# EAGLE design car_bt (EAGLE 7.5.0)
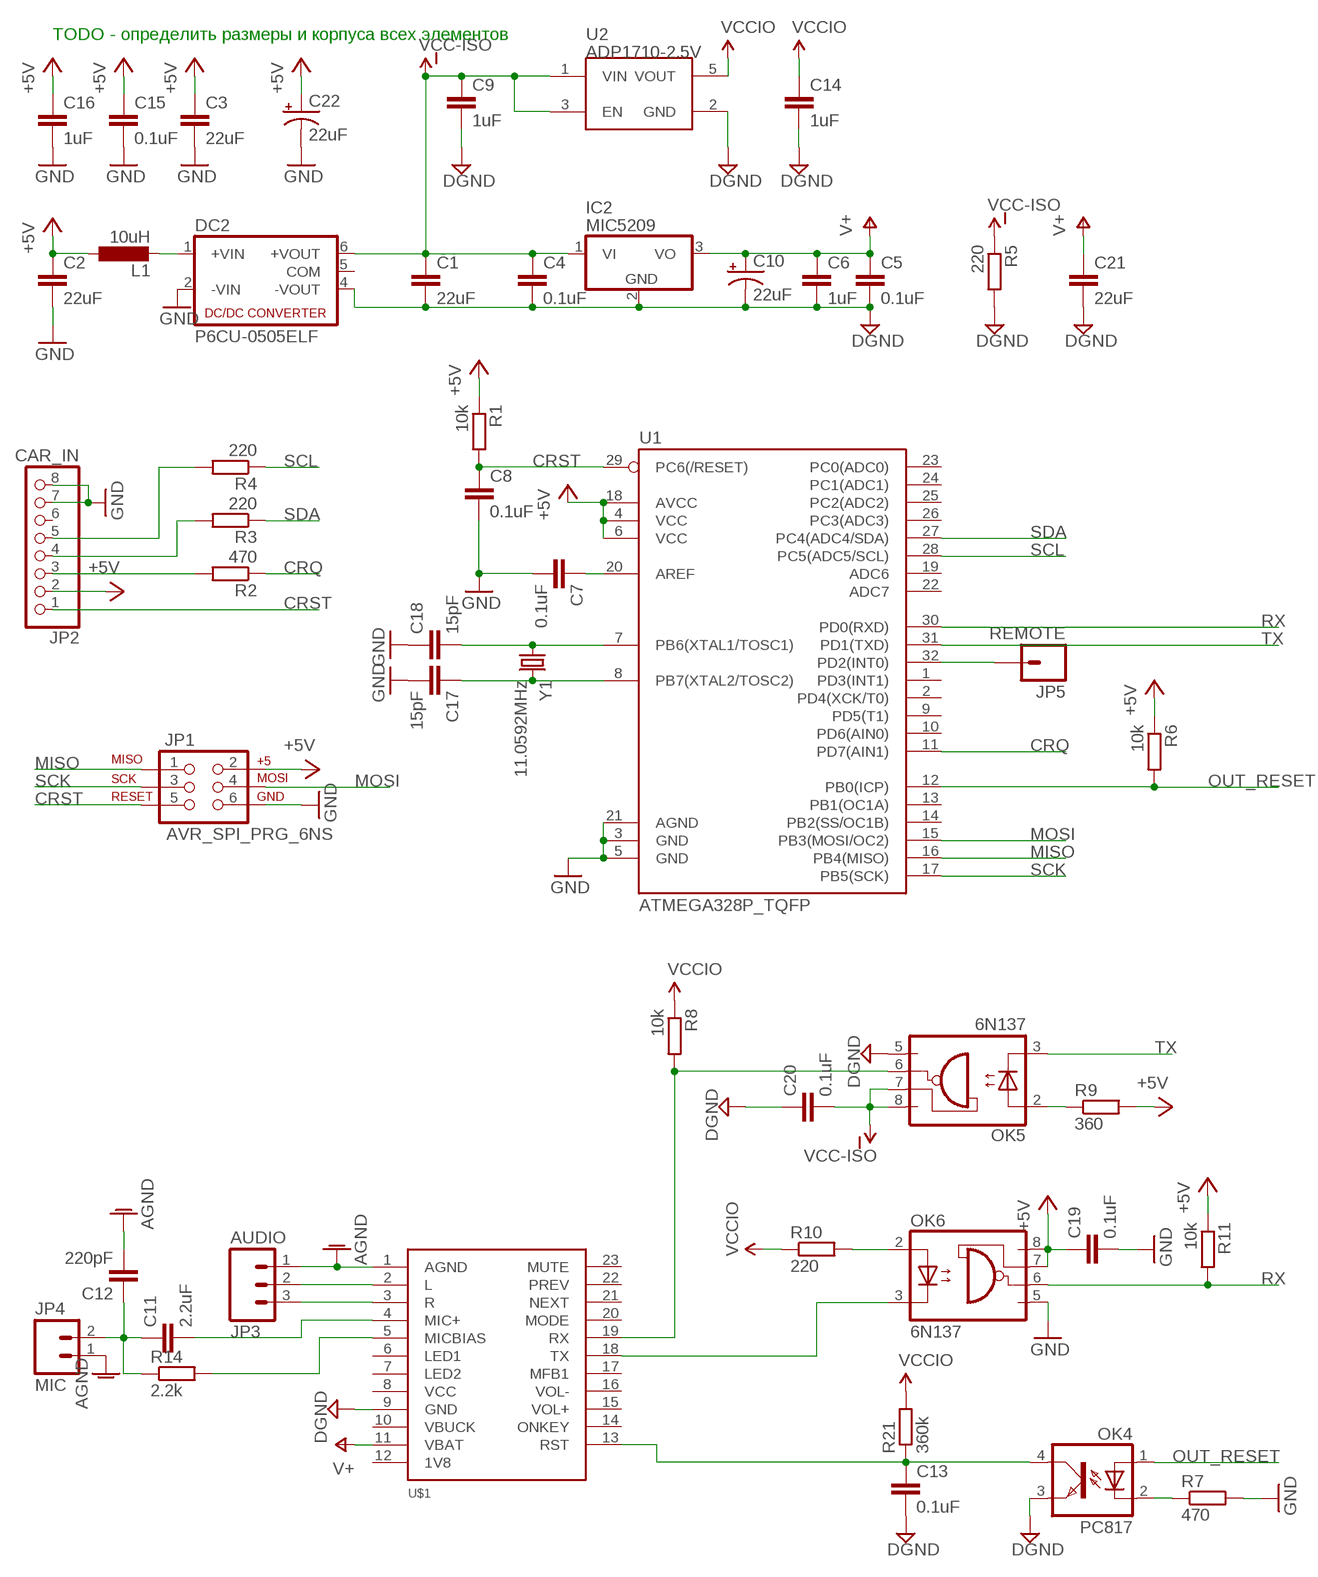
[diagram p0: schematic, sheet 1]

## Parts
C1  22uF  C-EUC1206  [C1206]
C2  22uF  C-EUC1206  [C1206]
C3  22uF  C-EUC1206  [C1206]
C4  0.1uF  C-EUC0805  [C0805]
C5  0.1uF  C-EUC0805  [C0805]
C6  1uF  C-EUC0805  [C0805]
C7  0.1uF  C-EUC0805  [C0805]
C8  0.1uF  C-EUC0805  [C0805]
C9  1uF  C-EUC0805  [C0805]
C10  22uF  CAP_POL3528  [EIA3528]
C11  2.2uF  C-EUC0805  [C0805]
C12  220pF  C-EUC0805  [C0805]
C13  0.1uF  C-EUC0805  [C0805]
C14  1uF  C-EUC0805  [C0805]
C15  0.1uF  C-EUC0805  [C0805]
C16  1uF  C-EUC0805  [C0805]
C17  15pF  C-EUC0805  [C0805]
C18  15pF  C-EUC0805  [C0805]
C19  0.1uF  C-EUC0805  [C0805]
C20  0.1uF  C-EUC0805  [C0805]
C21  22uF  C-EUC1206  [C1206]
C22  22uF  CAP_POL3528  [EIA3528]
DC2  P6CU-0505ELF  NMA  [NMA]
IC2  MIC5209  MCP1703DB  [SOT223]
JP1  AVR_SPI_PRG_6NS  [2X3-NS]
JP2  CAR_IN  PINHD-1X8/90  [1X08/90]
JP3  AUDIO  M03POLAR  [MOLEX-1X3]
JP4  MIC  M02POLAR_LOCK  [MOLEX-1X2_LOCK]
JP5  REMOTE  M01PTH_LONGPAD  [1X01_LONGPAD]
L1  10uH  L-EUL3216C  [L3216C]
OK4  PC817  [DIL04]
OK5  6N137  [DIL08]
OK6  6N137  [DIL08]
R1  10k  R-EU_R0805  [R0805]
R2  470  R-EU_R0805  [R0805]
R3  220  R-EU_R0805  [R0805]
R4  220  R-EU_R0805  [R0805]
R5  220  R-EU_R0805  [R0805]
R6  10k  R-EU_R0805  [R0805]
R7  470  R-EU_R0805  [R0805]
R8  10k  R-EU_R0805  [R0805]
R9  360  R-EU_R0805  [R0805]
R10  220  R-EU_R1206  [R1206]
R11  10k  R-EU_R0805  [R0805]
R14  2.2k  R-EU_R0805  [R0805]
R21  360k  R-EU_R0805  [R0805]
U1  ATMEGA328P_TQFP  [TQFP32-08]
U2  ADP1710-2.5V  ADP160  [SOT23-5]
U$1  XS3868  [XS3868]
Y1  11.0592MHz  CRYSTALHC49UV  [HC49U-V]

## Nets
+5V [HI_PWR]: C2.1 C3.1 C15.1 C16.1 C19.1 C22.A(+) JP1.2 JP2.2 L1.1 OK6.7(VE) OK6.8(VCC) R1.1 R6.1 R9.2 R11.1 U1.4(VCC) U1.6(VCC) U1.18(AVCC)
AGND [HI_PWR]: C12.2 JP3.1 JP4.1 U$1.1(AGND)
CRQ [PWR]: R2.1 U1.11(PD7(AIN1))
CRST [PWR]: C8.1 JP1.5 JP2.1 R1.2 U1.29(PC6(/RESET))
DGND [HI_PWR]: C1.2 C4.2 C5.2 C6.2 C9.2 C10.C(-) C13.2 C14.2 C20.1 C21.2 DC2.4(-VOUT) IC2.2(GND) OK4.3(EMIT) OK5.5(GND) R5.2 U2.2(GND) U$1.9(GND)
GND [HI_PWR]: C2.2 C3.2 C7.2 C8.2 C15.2 C16.2 C17.2 C18.1 C19.2 C22.C(-) DC2.2(-VIN) JP1.6 JP2.7 JP2.8 OK6.5(GND) R7.2 U1.3(GND) U1.5(GND) U1.21(AGND)
MISO: JP1.1 U1.16(PB4(MISO))
MOSI: JP1.4 U1.15(PB3(MOSI/OC2))
N$1 [PWR]: JP2.3 R2.2
N$2 [PWR]: JP2.4 R3.2
N$3 [PWR]: JP2.5 R4.2
N$4 [HI_PWR]: DC2.1(+VIN) L1.2
N$5: OK6.3(C) U$1.18(TX)
N$6: C7.1 U1.20(AREF)
N$7 [PWR]: C11.1 C12.1 JP4.2 R14.1
N$8 [PWR]: JP3.2 U$1.2(L)
N$9 [PWR]: JP3.3 U$1.3(R)
N$10 [PWR]: JP5.1 U1.32(PD2(INT0))
N$11 [PWR]: OK5.2(A) R9.1
N$12 [PWR]: C13.1 OK4.4(COL) R21.1 U$1.13(RST)
N$13: C17.1 U1.8(PB7(XTAL2/TOSC2)) Y1.2
N$14 [PWR]: OK5.6(VO) R8.2 U$1.19(RX)
N$15 [PWR]: OK6.2(A) R10.2
N$16: C18.2 U1.7(PB6(XTAL1/TOSC1)) Y1.1
N$18: OK4.2(C) R7.1
N$19 [PWR]: C11.2 U$1.4(MIC+)
N$20 [PWR]: R14.2 U$1.5(MICBIAS)
OUT_RESET [PWR]: OK4.1(A) R6.2 U1.12(PB0(ICP))
RX [PWR]: OK6.6(VO) R11.2 U1.30(PD0(RXD))
SCK: JP1.3 U1.17(PB5(SCK))
SCL [PWR]: R4.1 U1.28(PC5(ADC5/SCL))
SDA [PWR]: R3.1 U1.27(PC4(ADC4/SDA))
TX [PWR]: OK5.3(C) U1.31(PD1(TXD))
V+ [HI_PWR]: C5.1 C6.1 C10.A(+) C21.1 IC2.3(VO) U$1.11(VBAT)
VCC-ISO [HI_PWR]: C1.1 C4.1 C9.1 C20.2 DC2.6(+VOUT) IC2.1(VI) OK5.7(VE) OK5.8(VCC) R5.1 U2.1(VIN) U2.3(EN)
VCCIO [PWR]: C14.1 R8.1 R10.1 R21.2 U2.5(VOUT)
Unconnected: DC2.5(COM) JP2.6 U1.1(PD3(INT1)) U1.2(PD4(XCK/T0)) U1.9(PD5(T1)) U1.10(PD6(AIN0)) U1.13(PB1(OC1A)) U1.14(PB2(SS/OC1B)) U1.19(ADC6) U1.22(ADC7) U1.23(PC0(ADC0)) U1.24(PC1(ADC1)) U1.25(PC2(ADC2)) U1.26(PC3(ADC3)) U$1.6(LED1) U$1.7(LED2) U$1.8(VCC) U$1.10(VBUCK) U$1.12(1V8) U$1.14(ONKEY) U$1.15(VOL+) U$1.16(VOL-) U$1.17(MFB1) U$1.20(MODE) U$1.21(NEXT) U$1.22(PREV) U$1.23(MUTE)

## Notes on the sheet
- TODO - определить размеры и корпуса всех элементов

## Library data of the parts
C1-C9 C11-C21 = resistor:C-EU: CAPACITOR, European symbol
C10 C22 = SparkFun-Passives:CAP_POL: Capacitor Polarized These are standard SMD and PTH capacitors. Normally 10uF, 47uF, and 100uF in electrolytic and tantalum varieties. Always verify the external diameter of the through hole cap, it varies with capacity, voltage, and manufacturer. The EIA devices should be standard.
DC2 = dc-dc-converter:NMA: DC-DC CONVERTER; MF: C & D TECHNOLOGIES, INC; MPN: NMA0515SC; OC_FARNELL: 1021434; OC_NEWARK: 61K3064
IC2 = linear:MCP1703: 250 mA, 16V, Low Quiescent Current LDO Regulator Source: http://ww1.microchip.com/downloads/en/DeviceDoc/22049b.pdf
JP1 = SparkFun-Connectors:AVR_SPI_PRG_6: AVR ISP 6 Pin This is the reduced ISP connector for AVR programming. Common on Arduino. This footprint will take up less PCB space and can be used with a 10-pin to 6-pin adapter such as SKU: BOB-08508 **Special note about "TEST_POINT" package. The stop mask is on the top side, so if you want your programming test points to be on the bottom of your board, make sure to place this package on the bottom side of the board. This also ensure that the orientation to program from the bottom side will be correct.
JP2 = pinhead:PINHD-1X8: PIN HEADER
JP3 = SparkFun-Connectors:M03: Header 3 Standard 3-pin 0.1" header. Use with straight break away headers (SKU : PRT-00116), right angle break away headers (PRT-00553), swiss pins (PRT-00743), machine pins (PRT-00117), and female headers (PRT-00115). Molex polarized connector foot print use with SKU : PRT-08232 with associated crimp pins and housings.
JP4 = SparkFun-Connectors:M02: Standard 2-pin 0.1" header. Use with - straight break away headers ( PRT-00116) - right angle break away headers (PRT-00553) - swiss pins (PRT-00743) - machine pins (PRT-00117) - female headers (PRT-00115) Molex polarized connector foot print use with: PRT-08233 with associated crimp pins and housings. 2.54_SCREWTERM for use with PRT-10571. 3.5mm Screw Terminal footprints for PRT-08084 5mm Screw Terminal footprints for use with PRT-08432
JP5 = SparkFun-Connectors:M01: Header 1 Standard 1-pin 0.1" header. Use with straight break away headers (SKU : PRT-00116), right angle break away headers (PRT-00553), swiss pins (PRT-00743), machine pins (PRT-00117), and female headers (PRT-00115).
L1 = resistor:L-EU: INDUCTOR, European symbol
OK4 = optocoupler:PC817: SHARP OPTO COUPLER; MPN: PC817X4J000F; OC_FARNELL: 9707727; OC_NEWARK: 97K7059
OK5 OK6 = optocoupler:6N137: MOTOROLA OPTO COUPLER; MPN: 6N137; OC_FARNELL: 1328376; OC_NEWARK: 52M1895
R1-R11 R14 R21 = rcl:R-EU_: RESISTOR, European symbol
U1 = SparkFun-DigitalIC:ATMEGA328P_TQFP; PROD_ID: IC-09069
U2 = SparkFun-PowerIC:ADP160: Nanopower LDO Iq less than 1uA for low Iload; PROD_ID: VREG-11306; VALUE: ADP160
U$1 = xs3868:XS3868
Y1 = SparkFun-FreqCtrl:CRYSTAL: Various standard crystals. Proven footprints.

## Net classes
1 PWR: width 0.3 mm, drill 0.5 mm, clearance 0.2 mm
2 HI_PWR: width 0.5 mm, drill 0.5 mm, clearance 0.2 mm

## Board
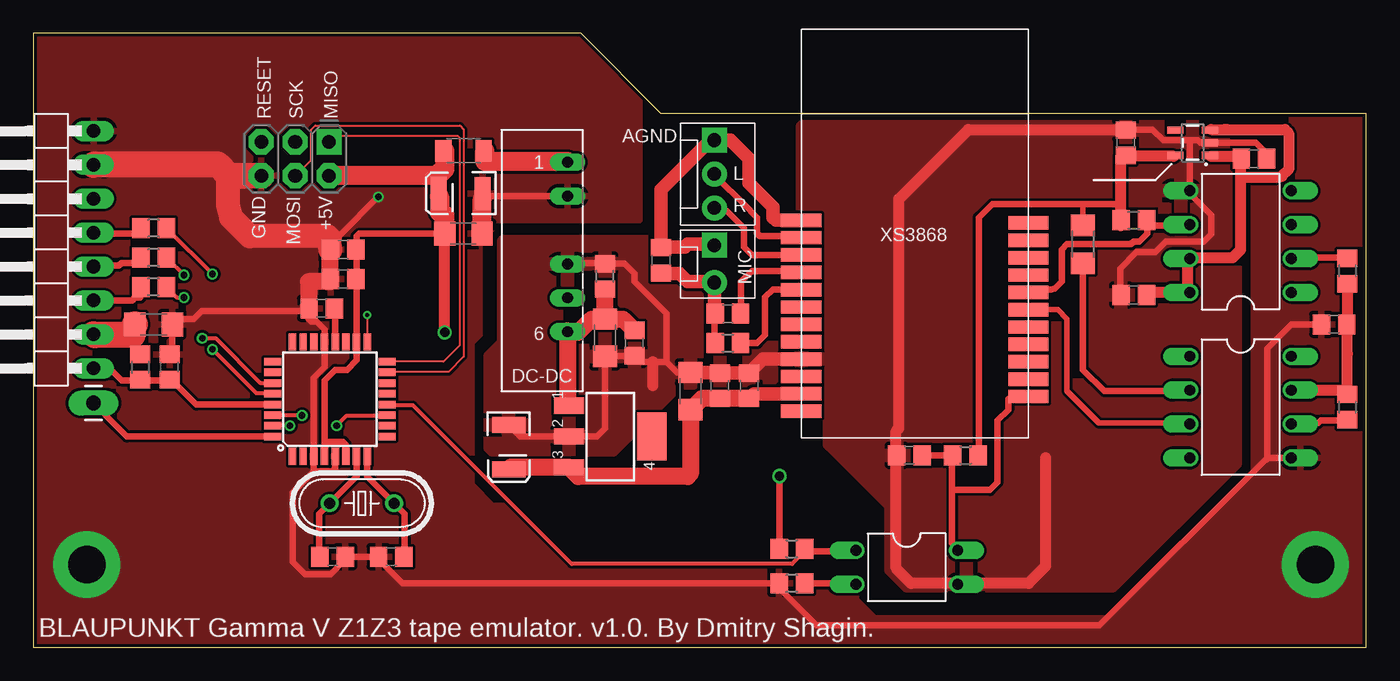
[diagram p1: board, top side]
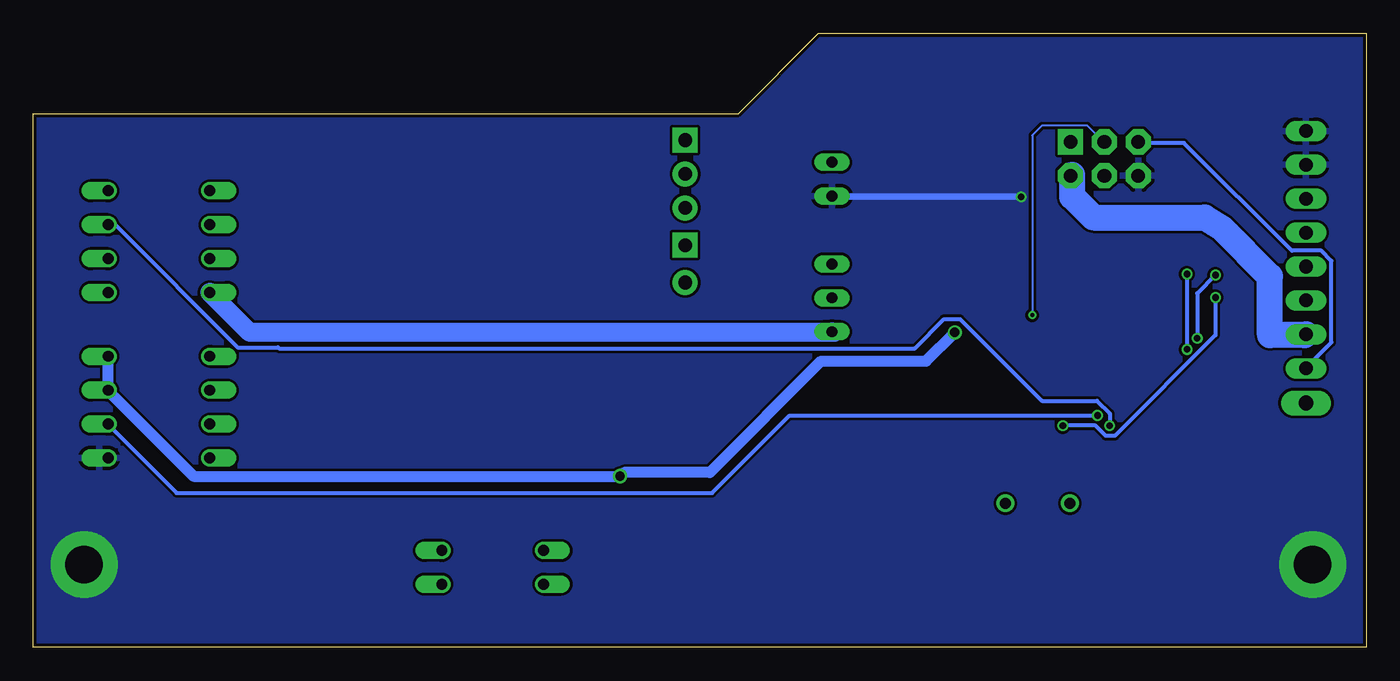
[diagram p2: board, bottom side, seen from below]

Size 99.8 x 46 mm. Coordinates in mm from the lower left corner, seen from the top.
Outline: 0,0 99.8,0 99.8,40 47,40 41,46 0,46 0,0
Copper layers (1*16): Top 0.035mm / dielectric 1.5mm / Bottom 0.035mm
Design rules "Fusion_eagle_rule_v1.1": minimum track width 6mil, minimum drill 12mil, track to track 6mil, track to pad 6mil, pad to pad 6mil, via to via 6mil, smd to smd 0mil, copper to edge 10mil, drill to drill 10mil, minimum pad ring 10mil, minimum via ring 6mil, stop-mask expansion 2mil, vias tented up to drill 100mil, thermal gap 10mil

### Footprints (pad centres in the part's own frame; a part is rotated, then mirrored left to right if it is on the bottom)
C1206 = smd 1.6 x 1.8: 1 -1.4,0; 2 1.4,0
C0805 = smd 1.3 x 1.5: 1 -0.95,0; 2 0.95,0
EIA3528 = smd 1.2 x 2.5: A 1.65,0; C -1.65,0
NMA = drill 0.813 long: 1 0,6.35; 2 0,3.81; 4 0,-1.27; 5 0,-3.81; 6 0,-6.35
SOT223 = smd 1.219 x 2.235: 1 -2.311,-3.099; 2 0,-3.099; 3 2.311,-3.099 | smd 3.6 x 2.2: 4 0,3.099
2X3-NS = drill 1.016 pad 1.88 square: 1 -2.54,-1.27 | drill 1.016 pad 1.88 octagon: 2 -2.54,1.27; 3 0,-1.27; 4 0,1.27; 5 2.54,-1.27; 6 2.54,1.27
1X08/90 = drill 1.016 long: 1 -8.89,-3.81; 2 -6.35,-3.81; 3 -3.81,-3.81; 4 -1.27,-3.81; 5 1.27,-3.81; 6 3.81,-3.81; 7 6.35,-3.81; 8 8.89,-3.81
MOLEX-1X3 = drill 1.016 pad 1.88 square: 1 0,0 | drill 1.016 pad 1.88: 2 2.54,0; 3 5.08,0
MOLEX-1X2_LOCK = drill 1.016 pad 1.88 square: 1 -0.127,0 | drill 1.016 pad 1.88: 2 2.667,0
1X01_LONGPAD = drill 1.118 pad 1.88 long: 1 0,0
L3216C = smd 1.2 x 1.6: 1 -1.5,0; 2 1.5,0
DIL04 = drill 0.813 offset: 1 -1.27,-3.81; 2 1.27,-3.81; 3 1.27,3.81; 4 -1.27,3.81
DIL08 = drill 0.813 offset: 1 -3.81,-3.81; 2 -1.27,-3.81; 3 1.27,-3.81; 4 3.81,-3.81; 5 3.81,3.81; 6 1.27,3.81; 7 -1.27,3.81; 8 -3.81,3.81
R0805 = smd 1.3 x 1.5: 1 -0.95,0; 2 0.95,0
R1206 = smd 1.6 x 1.803: 1 -1.422,0; 2 1.422,0
TQFP32-08 = smd 1.27 x 0.559: 1 -4.293,2.8; 2 -4.293,2; 3 -4.293,1.2; 4 -4.293,0.4; 5 -4.293,-0.4; 6 -4.293,-1.2; 7 -4.293,-2; 8 -4.293,-2.8; 17 4.293,-2.8; 18 4.293,-2; 19 4.293,-1.2; 20 4.293,-0.4; 21 4.293,0.4; 22 4.293,1.2; 23 4.293,2; 24 4.293,2.8 | smd 0.559 x 1.27: 9 -2.8,-4.293; 10 -2,-4.293; 11 -1.2,-4.293; 12 -0.4,-4.293; 13 0.4,-4.293; 14 1.2,-4.293; 15 2,-4.293; 16 2.8,-4.293; 25 2.8,4.293; 26 2,4.293; 27 1.2,4.293; 28 0.4,4.293; 29 -0.4,4.293; 30 -1.2,4.293; 31 -2,4.293; 32 -2.8,4.293
SOT23-5 = smd 0.55 x 1.2: 1 -0.95,-1.3; 2 0,-1.3; 3 0.95,-1.3; 4 0.95,1.3; 5 -0.95,1.3
XS3868 = smd 3 x 1: 1 -8.5,1; 2 -8.5,-0.3; 3 -8.5,-1.6; 4 -8.5,-2.9; 5 -8.5,-4.2; 6 -8.5,-5.5; 7 -8.5,-6.8; 8 -8.5,-8.1; 9 -8.5,-9.4; 10 -8.5,-10.7; 11 -8.5,-12; 12 -8.5,-13.3; 13 8.5,-12.2; 14 8.5,-10.9; 15 8.5,-9.6; 16 8.5,-8.3; 17 8.5,-7; 18 8.5,-5.7; 19 8.5,-4.4; 20 8.5,-3.1; 21 8.5,-1.8; 22 8.5,-0.5; 23 8.5,0.8
HC49U-V = drill 0.813: 1 -2.413,0; 2 2.413,0

### Placement (x,y rotation side)
C1  42.8,23.2 270 top
C2  32.2,31 0 top
C3  9,24.2 0 top
C4  45,22.8 270 top
C5  53.6,19.6 90 top
C6  51.4,19.6 90 top
C7  21.6,25.4 180 top
C8  10.2,21 90 top
C9  91.4,36.6 0 top
C10  35.6,15 270 top
C11  52,25 0 top
C12  47,29 90 top
C13  65.6,14.4 180 top
C14  81.8,37.8 90 top
C15  23.2,27.6 180 top
C16  23.2,29.8 180 top
C17  26.8,6.8 180 top
C18  22.4,6.8 180 top
C19  97.4,24.2 180 top
C20  82.4,26.4 0 top
C21  49.2,19.2 90 top
C22  32,34 180 top
DC2  40,30 0 top
IC2  43.2,15.8 270 top
JP1  19.6,36.6 180 top
JP2  0.7,29.8 90 top
JP3  51,38 270 top
JP4  51,30 270 top
JP5  4.5,18.3 90 top
L1  32.2,37.2 0 top
OK4  65.4,6 270 top
OK5  90.4,30.4 90 top
OK6  90.4,18 270 top
R1  8,21 270 top
R2  9,27 180 top
R3  9,29.2 180 top
R4  9,31.4 180 top
R5  42.8,27.8 90 top
R6  56.8,7.4 0 top
R7  56.8,4.8 180 top
R8  82.4,32 0 top
R9  98.4,28.2 270 top
R10  78.6,30.2 270 top
R11  98.4,18 270 top
R14  52,22.8 0 top
R21  69.8,14.4 0 top
U1  22.2,18.6 90 top
U2  86.8,37.8 90 top
U$1  66,31 0 top
Y1  24.6,10.8 0 top

### Tracks (layer width: path | path; a pad name or v marks a point on that pad's centre or on a via)
+5V  (via drill 0.7)
  Top 0.5: 30.8,35.8 30.6,35.6 | 30.8,37.2 L1.1 | 30.6,32.4 30.8,32.4 | 30.4,33.8 C22.A 30.4,34 30.4,35.6 30.2,35.4 | 98.4,24.2 C19.1 98.4,24 | 98.4,22 98.4,21.6 98.51,21.49 98.51,19 98.4,19 R11.1 98.2,19 | C3.1 7.6,22.2 7.8,22 8,22 R1.1 | C2.1 24.4,31 24.2,30.8 24.2,30 C16.1 24.2,29.8 24.2,27.6 C15.1 24.2,27.4 U1.18 24.2,21.52 23.48,20.8 22.6,20.8 21.8,20 21.8,15.4 | 22.6,35.4 JP1.2 | U1.4 21.8,15.4 | 21.8,15.4 23.2,15.4 23.4,15.2 U1.6 | v55.87,12.83 55.85,7.62 55.85,7.47 R6.1
  Top 0.813: R9.2 98.4,24.2 | 98.4,24 98.4,22 98.4,19.27 OK6.7 | v30.8,23.6 C2.1
  Top 1.422: 30.6,35.6 30.4,35.6 | 30.8,37.2 30.8,35.8 | 30.8,32.4 C2.1 | 30.6,32.4 30.4,32.6 30.4,33.8 | 22.6,35.4 30.2,35.4
  Top 1.93: JP2.2 4.6,23.4 7.4,23.4 C3.1
  Bottom 0.5: 94.18,19.2 OK6.7
  Bottom 0.813: 94.18,19.2 87.81,12.83 v55.87,12.83 55.56,13.11 49.15,13.11 40.8,21.45 32.95,21.45 v30.8,23.6 | OK6.7 OK6.8
  Bottom 1.93: JP2.2 4.6,23.4 7.2,23.4 7.2,27.8 10.8,31.4 12.09,32.2 20.44,32.2 22,33.76 22,35.4 JP1.2
AGND
  Top 0.5: 51,30.2 JP4.1 | 47.2,30 C12.2
  Top 1.016: C12.2 47,34.31 50.69,38 JP3.1 52.2,38 53.6,36.6 53.6,34.8 55.4,33 55.4,32.2 55.6,32 U$1.1 | 51,30.2 49,30.2 48.8,30 47.2,30
CRQ  (via drill 0.5)
  Top 0.3: v22.71,16.61 23.47,17.37 26.44,17.37 U1.11 | v11.28,26.21 10.74,26.21 9.98,26.98 R2.1
  Bottom 0.3: v22.71,16.61 20.27,16.61 19.51,15.85 18.82,15.85 11.28,23.39 v11.28,26.21
CRST
  Top 0.5: JP2.1 4.6,21 5.6,21 6.6,20 8,20 R1.2 8.2,20 10.2,20 C8.1 10.4,20 12.2,18.2 U1.29
  Bottom 0.3: JP1.5 16.99,37.8 13.64,37.8 5.56,29.72 3.35,29.72 2.59,28.96 2.59,22.86 4.5,20.95 JP2.1
DGND
  Top 0.5: DC2.4 40,28.8 42.8,28.8 R5.2 44.25,28.75 45,28 45,27.4 47.4,25 47.4,21.4 | 86.6,38 87.2,38 87.4,37.8 U2.2 91.55,37.8 92.4,36.95 92.4,36.6 C9.2 | 86.6,38 84.6,38 83.8,38.8 81.8,38.8 C14.2 81.6,38.8 | 86.6,38 86.6,34.4 OK5.5 86.6,34 88.2,32.4 88.2,30.97 87.63,30.4 84.8,30.4 84,29.6 82.6,29.6 81.4,28.4 81.4,26.4 C20.1 | 64.6,14.4 C13.2 64.6,14.6 | 69.2,4.8 OK4.3 69.4,4.8 | 47.4,21.4 46.4,21.4 45.45,21.4 C4.2 42.85,21.85 C1.2 42.8,16.4 42.2,15.8 IC2.2 36.45,15.8 C10.C | C21.2 48.2,20.6 47.4,21.4 | 51.35,20.6 C6.2
  Top 0.813: 69.2,4.8 65.73,4.8 64.6,5.93 64.6,14.4 | 75.8,14.2 75.8,6.08 74.52,4.8 69.4,4.8 | 81.6,38.8 70,38.8 64.8,33.6 64.8,16.4 64.6,16.2 64.6,14.6 | 46.4,19.6 46.4,21.4
  Top 1.016: C21.2 51.35,20.6 | C6.2 C5.2 54.65,21.6 U$1.9
  pour Top: 34.4,14.8 43.4,14.8 48.4,19.8 55,19.8 56,20.8 59.6,20.8 59.6,15.2 59.64,15.2 64.2,10.64 64.2,5.8 65.4,4.6 80.8,4.6 90,13.8 90,38.8 89.8,39 57.6,39 57.6,26.8 57.4,26.6 49.8,26.6 46,30.4 35.2,30.4 35.2,22.8 34.2,21.8 34.2,15
GND  (via drill 0.5, 2.8 pad 5)
  Top 0.5: DC2.2 33.6,33.8 33.6,34 C22.C 33.6,33.6 | 92.4,14.2 92.4,22.4 94.2,24.2 C19.2 | 92.4,14.2 OK6.5 | C8.2 10.2,22 10.4,22.2 C3.2 10.4,24.6 12,24.6 12.6,25.2 20.4,25.2 C7.2 20.6,25.4 20.6,24.6 20.8,24.4 21.2,24.4 21.8,23.8 U1.21 21.8,21 21,20.2 U1.3 21,13.2 | 22.2,27.4 22,27.4 | 22.2,27.6 C15.2 22.2,27.8 | 22.2,29.8 C16.2 | 21,13.2 22.4,13.2 22.6,13.4 U1.5 | v25.83,33.76 23.01,30.94 22.2,30.6 | 92.4,14.2 92.35,14.1 92.28,14.1 79.84,1.66 58.65,1.66 55.73,4.57 R7.2 55.78,4.8 27.66,4.8 25.91,6.55 C17.2 25.83,6.78 23.39,6.78 C18.1 23.32,6.55 22.25,5.49 20.35,5.49 19.42,6.42 19.42,11.62 20.95,13.15 | 20.95,13.15 | 20.95,13.15 21,13.2
  Top 1.27: 22,27.4 20.6,27.4 20.6,25.6 C7.2 | 22.2,27.6 22.2,27.4 | 22.2,29.8 22.2,27.8
  Top 1.422: C2.2 33.6,33.6
  Top 1.778: C16.2 22.2,30 22.2,30.6 22,30.8 16.2,30.8 14.8,32.2 14.6,33 14.6,35.2 | 14.6,35.4 14.6,35.2 | 14.6,35.2 JP1.6
  Top 1.93: JP1.6 14.6,35.4 13.8,36.2 4.6,36.2 JP2.7
  Bottom 0.5: v25.83,33.76 39.93,33.76 DC2.2
  other vias: 96,6.2 4,6.2
  pour Bottom: 0,46 100,46 100,0 0,0
  pour Top: -1,46 43.2,46 45.4,43.8 45.4,32 35,32 34.2,31.2 34,31.2 33.4,30.6 33.4,23.4 32.8,22.8 32.8,12.2 34.4,10.6 61.6,10.6 61.6,3.6 63,2.2 80.4,2.2 91.4,13.2 91.4,40.6 102.4,40.6 102.8,40.2 102.8,1.4 100,-1.4 -1,-1.4 -2.8,0.4 -2.8,44.2
MISO
  Top 0.152: U1.16 26.52,21.41 30.72,21.41 31.93,22.62 31.93,38.18 31.78,38.33 22.63,38.33 22.17,37.87 JP1.1
MOSI
  Top 0.152: U1.15 26.52,20.65 31.09,20.65 32.23,21.79 32.23,38.8 31.94,39.09 21.11,39.09 20.8,38.79 20.8,36.5 19.66,35.36 JP1.4
N$1
  Top 0.5: R2.2 8,27 8,26.2 7.6,26.2 7.4,26 4.6,26 JP2.3
N$2
  Top 0.5: R3.2 8,29.2 8,28.8 6.6,28.8 6.4,28.6 4.6,28.6 JP2.4
N$3
  Top 0.5: R4.2 8,31.4 8,31 4.6,31 JP2.5
N$4
  Top 0.5: 33.8,37.2 L1.2 | 40,36.4 DC2.1
  Top 1.422: 33.8,37.2 33.8,36.4 40,36.4
N$5
  Top 0.406: U$1.18 76.7,25.3 77.4,24.6 77.4,19.2 79.8,16.8 86.52,16.8 OK6.3
N$6
  Top 0.5: U1.20 22.6,25.4 C7.1
N$7
  Top 0.5: 51,27.4 JP4.2 | 47,28 C12.1 | R14.1 51,22.8 51,25 C11.1 51,25.2
  Top 1.016: 51,27.4 49,27.4 48.4,28 47,28 | 51,25.2 JP4.2
N$8
  Top 0.5: JP3.2 51,35.4 51.2,35.6 51.2,35.2 53.2,33.2 54.2,32.2 54.2,31 54.4,30.8 55.6,30.8 57.4,30.8 U$1.2
N$9
  Top 0.5: U$1.3 55.2,29.4 53.8,29.4 53.2,30 53.2,31.4 52,32.6 51.6,33 51,33 JP3.3
N$10
  Top 0.5: U1.32 7,15.8 6.2,16.6 JP5.1
N$11
  Top 0.5: OK5.2 94.4,29.2 98.4,29.2 R9.1
N$12
  Top 0.5: C13.1 R21.1 68.8,14.2 68.8,11.8 | 68.8,11.8 68.8,7.8 69.2,7.4 OK4.4 | 73,18.6 73.4,18.6 73.6,18.8 73,18.6 | 68.8,11.8 71.63,11.8 72.2,12.37 72.2,17 73,17.8 73,18.6
  Top 0.813: U$1.13 73.6,18.8
N$13
  Top 0.5: U1.8 25,12.81 Y1.2 27.8,10.01 27.8,6.8 C17.1
N$14
  Top 0.5: OK5.6 86.4,31.6 83.6,31.6 83.4,31.8 R8.2 83.4,31.4 83.4,31 82.8,30.4 82.4,30.4 82.2,30.2 77.4,30.2 77,29.8 77,27.4 76.5,26.9 76.2,26.8 75.8,26.8 75.6,26.6 U$1.19
N$15
  Top 0.5: OK6.2 86.4,19.2 80.2,19.2 78.6,20.8 R10.2
N$16
  Top 0.5: U1.7 24.2,12.81 Y1.1 21.4,10.01 21.4,6.8 C18.2
N$18
  Top 0.5: R7.1 61.4,4.8 OK4.2
N$19
  Top 0.5: U$1.4 57.4,28.2 53.8,28.2 53,27.4 53,25 C11.2
N$20
  Top 0.5: U$1.5 55.37,26.8 54.8,26.23 54.8,23.4 54.2,22.8 R14.2
OUT_RESET
  Top 0.3: U1.12 26.52,18.14 28.42,18.14 40.31,6.25 56.82,6.25 57.73,7.16 R6.2
  Top 0.5: OK4.1 61.4,7.2 57.8,7.2 57.6,7.4 R6.2
RX  (via drill 0.5)
  Top 0.3: v20.12,17.37 17.98,17.37 U1.30
  Top 0.5: OK6.6 94.4,16.8 96.2,16.8 96.4,17 98.4,17 R11.2
  Bottom 0.3: v20.12,17.37 43.17,17.37 48.97,11.57 89.07,11.57 94.18,16.69 OK6.6
SCK  (via drill 0.3)
  Top 0.152: v24.99,24.89 24.99,22.94 U1.17
  Bottom 0.152: v24.99,24.89 24.99,38.37 24.28,39.09 20.88,39.09 19.66,37.87 JP1.3
SCL  (via drill 0.5)
  Top 0.3: v13.41,22.33 16.69,19.05 17.91,19.05 U1.28 | v13.41,27.96 9.98,31.39 R4.1
  Bottom 0.3: v13.41,27.96 v13.41,22.33
SDA  (via drill 0.5)
  Top 0.3: v12.65,23.16 13.64,23.16 16.99,19.81 17.91,19.81 U1.27 | v11.28,27.89 9.98,29.18 R3.1
  Bottom 0.3: v12.65,23.16 12.65,26.52 v11.28,27.89
TX  (via drill 0.5)
  Top 0.3: v19.2,16.61 17.98,16.61 U1.31
  Bottom 0.3: v19.2,16.61 19.2,17.53 20.16,18.48 24.28,18.48 30.4,24.6 31.6,24.6 33.8,22.4 81.4,22.4 81.48,22.48 84.51,22.48 93.65,31.62 94.18,31.62 OK5.3
V+
  Top 0.5: 49.2,13 49,12.8 | 35.74,13.49 C10.A | 52.24,18.36 52,18.6 50,18.8 49.2,17.56 | 57.68,18.9 U$1.11
  Top 1.016: U$1.11 53.95,19 C5.1
  Top 1.27: C5.1 C6.1 50.05,18.65 C21.1 49.2,17.56 49.2,13 | 49,12.8 40.79,12.8 IC2.3 35.74,13.49
VCC-ISO
  Top 0.5: 40,23.6 40.8,23.6 | 90.4,36.8 90.4,36.6 C9.1 90.4,36.4 | 88.2,36.8 U2.1 | 88.2,38.8 U2.3 | 93.5,35.3 93.4,35.2 | 86.6,29.2 OK5.7 | 86.4,26.6 OK5.8 86.2,26.6 | 83.4,26.6 83.4,26.4 C20.2 | 40,18.21 IC2.1
  Top 0.813: 88.2,36.8 90.4,36.8 | 88.2,38.8 89.2,38.8 89.4,38.8 93.72,38.8 94,38.52 94,35.8 93.5,35.3 93.2,35.2 90.4,35.2 | 90.4,35.2 90.4,36.4 | 86.6,29.2 89.8,29.2 90.4,29.8 90.4,35.2 | 86.4,26.6 86.4,29 OK5.7 | 86.2,26.6 83.4,26.6
  Top 1.27: C1.1 41.8,24.6 40.8,23.6 | 40,23.6 40,18.21 | C1.1 R5.1 | C1.1 44.15,24.6 C4.1
  Top 1.422: 40,23.6 DC2.6
  Bottom 1.422: 40,23.6 83.6,23.6 OK5.8 | 39.8,23.6 40,23.6 | 40,23.6 DC2.6
VCCIO
  Top 0.406: R10.1 78.6,33.2
  Top 0.5: 81.8,36.8 C14.1 81.6,36.8 81.4,36.8 | 85.4,36.8 U2.5 | 81.4,31.6 R8.1 | 81.4,33.2 78.6,33.2 71.8,33.2 70.8,32.2 70.8,14.4 R21.2
  Top 0.813: 85.4,36.8 81.8,36.8 | 81.4,36.8 81.4,33.2 81.4,31.6

### Text on the board
tNames: RESET | SCK | MISO | AGND | L | GND | MOSI | +5V | R | XS3868 | MIC | BLAUPUNKT Gamma V Z1Z3 tape emulator. v1.0. By Dmitry Shagin.